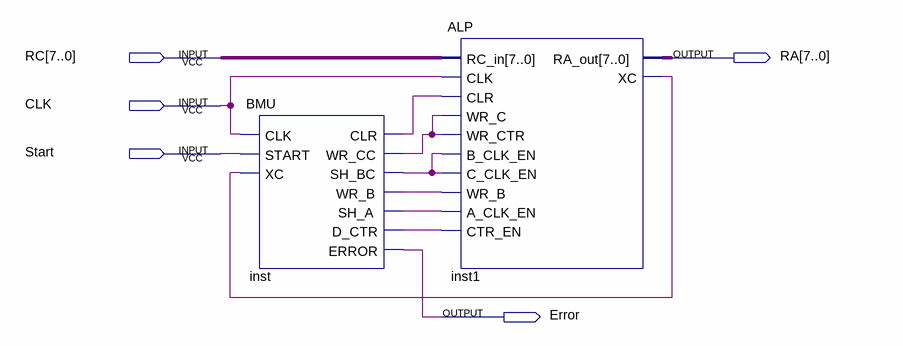
[diagram p0: schematic sheet]
// Quartus schematic SQRT.bdf as structural Verilog: 2 symbols, 5 pins
module SQRT (
  input  [7:0] RC,
  input  CLK,
  input  Start,
  output [7:0] RA,
  output Error
);

  wire inst1_xc, inst_clr, inst_d_ctr, inst_sh_a, inst_sh_bc, inst_wr_b, inst_wr_cc;

  BMU inst (
    .CLK(CLK), .START(Start), .XC(inst1_xc), .CLR(inst_clr), .WR_CC(inst_wr_cc), .SH_BC(inst_sh_bc),
    .WR_B(inst_wr_b), .SH_A(inst_sh_a), .D_CTR(inst_d_ctr), .ERROR(Error));
  ALP inst1 (
    .RC_in(RC), .CLK(CLK), .CLR(inst_clr), .WR_C(inst_wr_cc), .WR_CTR(inst_wr_cc), .B_CLK_EN(inst_sh_bc),
    .C_CLK_EN(inst_sh_bc), .WR_B(inst_wr_b), .A_CLK_EN(inst_sh_a), .CTR_EN(inst_d_ctr), .RA_out(RA),
    .XC(inst1_xc));
endmodule
